# EAGLE design SimpleSwitchOrig (EAGLE 6.6.0)
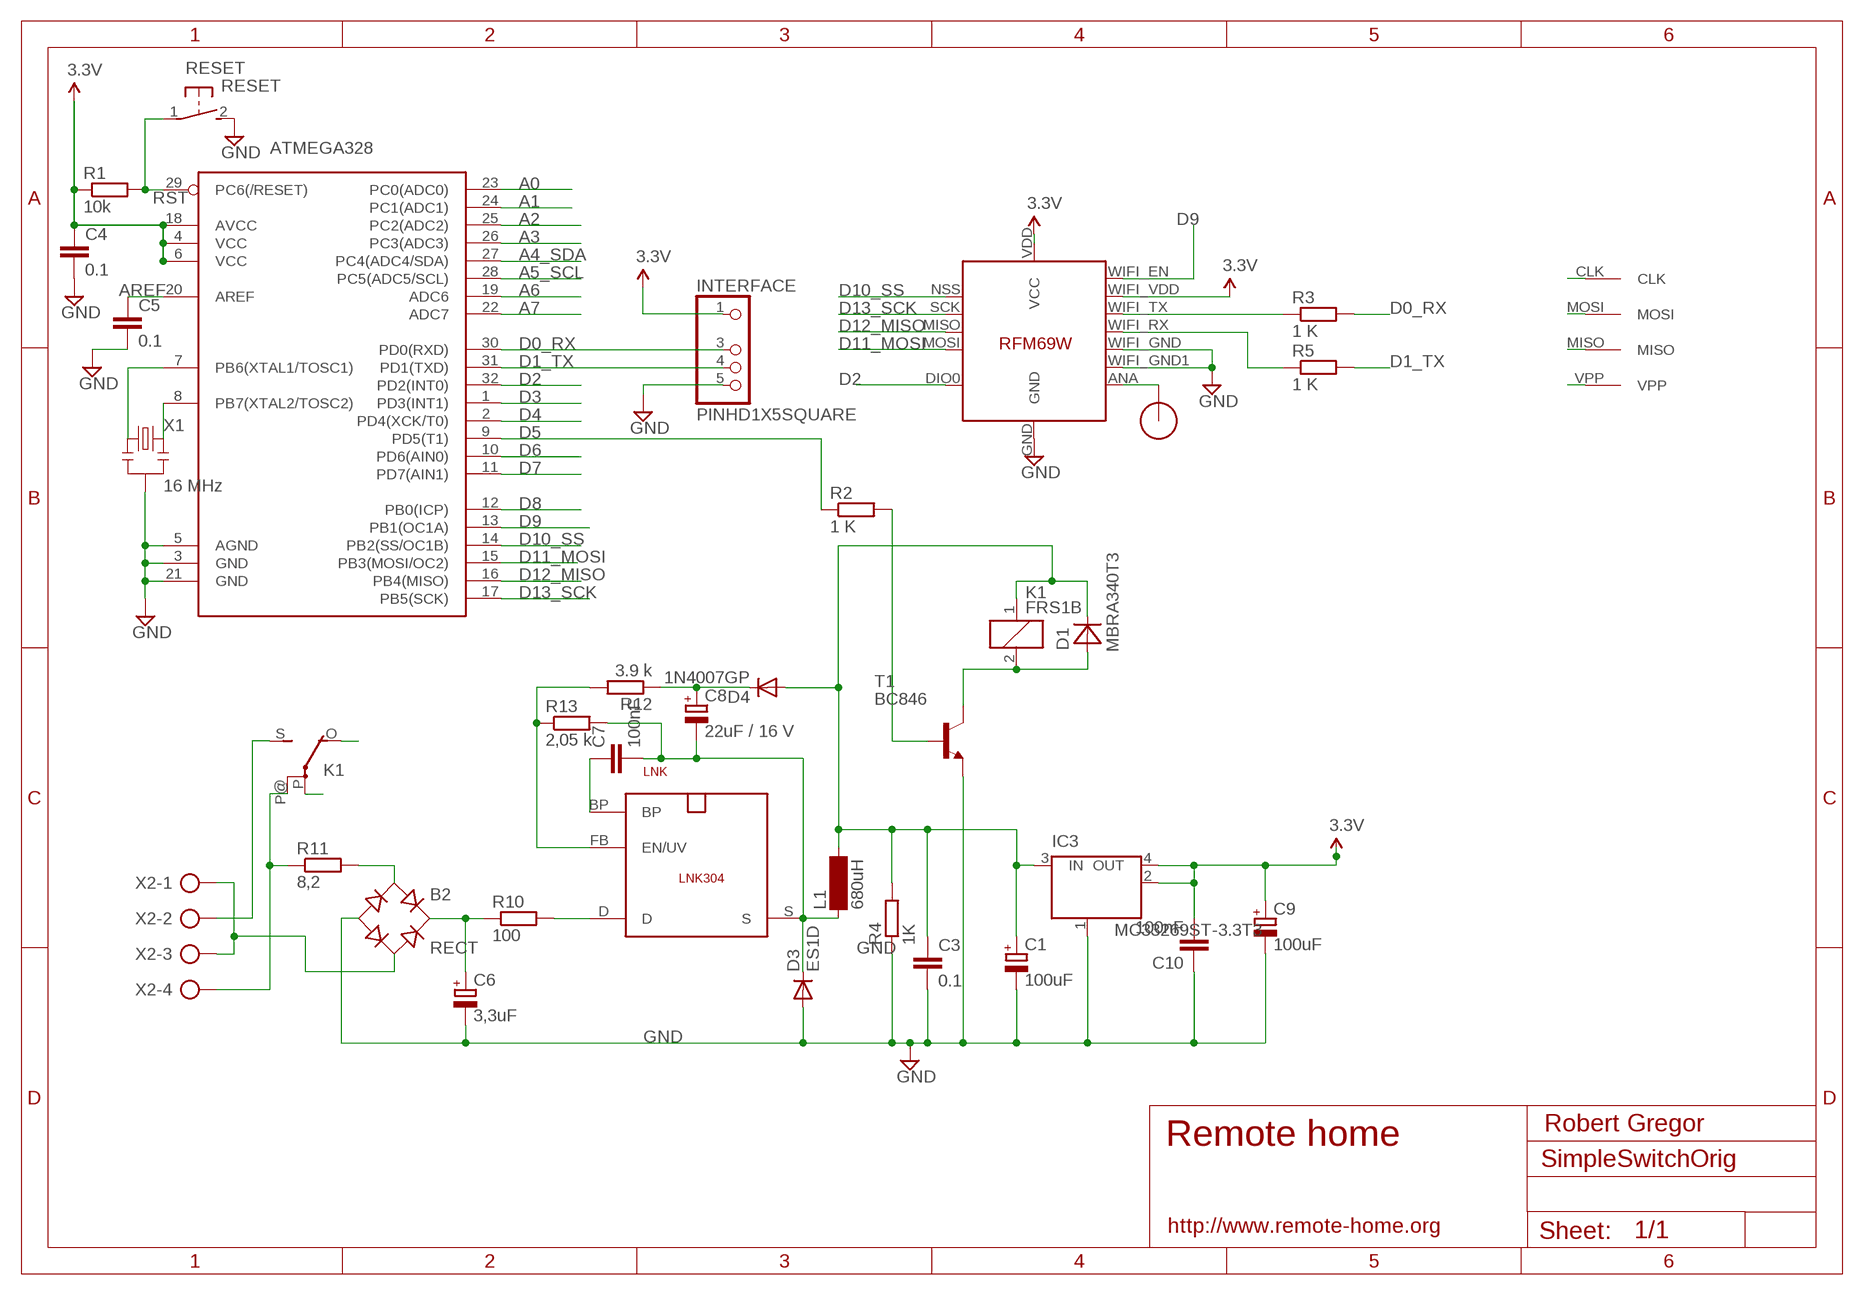
[diagram p0: schematic, sheet 1]

## Parts
ATMEGA328  ATMega-328  ATMEGA168/328TQFP32  [TQFP32-08]
B2  RECT  RECTIFIER-S40  [TO-269AA]
C1  100uF  CPOL-EUSMCB  [SMC_B]
C3  0.1  C-EUC2012  [C2012]
C4  0.1  C-EUC2012  [C2012]
C5  0.1  C-EUC2012  [C2012]
C6  3,3uF  CPOL-EUE5-10.5  [E5-10,5]
C7  100nF  C-EUC2012  [C2012]
C8  22uF / 16 V  CPOL-EUSMCC  [SMC_C]
C9  100uF  CPOL-EUSMCB  [SMC_B]
C10  100nF  C-EUC2012  [C2012]
D1  MBRA340T3  [SMA]
D3  ES1D  DIODE-DO214AC  [DO214AC]
D4  1N4007GP  DIODE-DO214AA  [DO214AA]
IC3  MC33269ST-3.3T3  [SOT223]
INTERFACE  PINHD1X5SQUARE  [PINHD1X05-SQUARE]
K1  FRS1B  [FRS1B]
L1  680uH  BS11  [BS11]
LNK  LNK304  SO-8C  [SO-8C]
R1  10k  R-EU_R2012  [R2012]
R2  1 K  R-EU_M2012  [M2012]
R3  1 K  R-EU_M2012  [M2012]
R4  1K  R-EU_M2012  [M2012]
R5  1 K  R-EU_M2012  [M2012]
R10  100  R-EU_R2512W  [R2512W]
R11  8,2  R-EU_0411/12  [0411/12]
R12  3.9 k  R-EU_M2012  [M2012]
R13  2,05 k  R-EU_M2012  [M2012]
RESET  RESET  DTSM-3  [DTSM-3]
RFM69  RFM69-ESP03  [RFM69W-ESP03]
T1  BC846  [SOT23]
U$1  RFM12B_ANTENNA  [RFM12B-ANTENNA]
U$2  AVRHEADERDIP  [AVRHEADER]
X1  16 MHz  RESONATORSMD  [RESONATOR-SMD]
X2  AK500/4  [AK500/4]

## Nets
5V: C1.+ C3.1 D1.C D4.A IC3.3(IN) K1.1 L1.2 R4.2
A0: ATMEGA328.23(PC0(ADC0))
A1: ATMEGA328.24(PC1(ADC1))
A2: ATMEGA328.25(PC2(ADC2))
A3: ATMEGA328.26(PC3(ADC3))
A4_SDA: ATMEGA328.27(PC4(ADC4/SDA))
A5_SCL: ATMEGA328.28(PC5(ADC5/SCL))
A6: ATMEGA328.19(ADC6)
A7: ATMEGA328.22(ADC7)
AREF: ATMEGA328.20(AREF) C5.1
D0_RX: ATMEGA328.30(PD0(RXD)) INTERFACE.3 R3.2
D1_TX: ATMEGA328.31(PD1(TXD)) INTERFACE.4 R5.2
D2: ATMEGA328.32(PD2(INT0)) RFM69.DIO0
D3: ATMEGA328.1(PD3(INT1))
D4: ATMEGA328.2(PD4(XCK/T0))
D5: ATMEGA328.9(PD5(T1)) R2.1
D6: ATMEGA328.10(PD6(AIN0))
D7: ATMEGA328.11(PD7(AIN1))
D8: ATMEGA328.12(PB0(ICP))
D9: ATMEGA328.13(PB1(OC1A)) RFM69.WIFI_EN
D10_SS: ATMEGA328.14(PB2(SS/OC1B)) RFM69.NSS(SEL)
D11_MOSI: ATMEGA328.15(PB3(MOSI/OC2)) RFM69.MOSI U$2.MOSI
D12_MISO: ATMEGA328.16(PB4(MISO)) RFM69.MISO U$2.MISO
D13_SCK: ATMEGA328.17(PB5(SCK)) RFM69.SCK U$2.CLK
FB: LNK.FB(EN/UV) R12.2 R13.1
GND [power]: ATMEGA328.3(GND) ATMEGA328.5(AGND) ATMEGA328.21(GND) B2.- C1.- C3.2 C4.2 C5.2 C6.- C9.- C10.1 D3.A IC3.1(GND/ADJ) INTERFACE.5 R4.1 RESET.2 RFM69.GND RFM69.WIFI_GND RFM69.WIFI_GND1 T1.2(E) X1.2
N$1: ATMEGA328.7(PB6(XTAL1/TOSC1)) X1.1
N$2: R2.2 T1.1(B)
N$3: RFM69.ANA(ANT) U$1.P$1
N$4 [220V]: K1.P(2:P)
N$5: D1.A K1.2 T1.3(C)
N$6 [220V]: K1.O(2:O)
N$7 [220V]: K1.S(2:S) X2.2
N$8 [220V]: K1.P@(2:P) R11.1 X2.4
N$9 [220V]: B2.AC2 X2.1 X2.3
N$10: R3.1 RFM69.WIFI_TX
N$11: R5.1 RFM69.WIFI_RX
N$13 [220V]: LNK.D R10.2
N$14 [220V]: B2.+ C6.+ R10.1
N$15 [220V]: B2.AC1 R11.2
N$18: C7.1 LNK.BP
N$20: C8.+ D4.C R12.1
N$21: ATMEGA328.8(PB7(XTAL2/TOSC2)) X1.3
RST: ATMEGA328.29(PC6(/RESET)) R1.2 RESET.1 U$2.VPP
S: C7.2 C8.- D3.C L1.1 LNK.S R13.2
VCC: ATMEGA328.4(VCC) ATMEGA328.6(VCC) ATMEGA328.18(AVCC) C4.1 C9.+ C10.2 IC3.2(OUT) IC3.4(OUT) INTERFACE.1 R1.1 RFM69.VDD(VCC) RFM69.WIFI_VDD ; supply symbol labelled 3.3V

## Notes on the sheet
- Robert Gregor
- Remote home
- http://www.remote-home.org

## Library data of the parts
ATMEGA328 = LowPowerLab:ATMEGA168/328: Atmel 32-pin 8-bit micro, 16k flash.
B2 = rectifier:RECTIFIER-: Rectifier
C1 C6 C8 C9 = resistor:CPOL-EU: POLARIZED CAPACITOR, European symbol
C3-C5 C7 C10 = resistor:C-EU: CAPACITOR, European symbol
D1 = diode:MBRA340T3: Surface Mount Schottky Power Rectifier Source: http://www.onsemi.com/pub_link/Collateral/MBRA340T3-D.PDF
D3 D4 = diode:DIODE-: DIODE
IC3 = linear:MC33269ST*: Adjustable Output Low Dropout Voltage Regulator 800 mA Source: http://www.onsemi.com/pub/Collateral/MC33269-D.PDF
INTERFACE = eagle-library-edeca.net-v5:PINHD1X5
K1 = relay:FRS1B: RELAY 1 x switch, same as V23101-D6-A201, Siemens; OC_FARNELL: unknown; OC_NEWARK: unknown
L1 = inductor-neosid:BS: INDUCTOR nominal inductance, magnetically screened; OC_FARNELL: unknown; OC_NEWARK: unknown
LNK = powerint:SO-8C: 700V MOSFET für Schaltnetz-Trafos. Pin 3 fehlt. SMD
R1-R5 R10-R13 = resistor:R-EU_: RESISTOR, European symbol
RESET = switch-tact:DTSM-3
RFM69 = RemoteHome:RFM69-ESP03
T1 = transistor:BC846: NPN TRANSISTOR
U$1 = LowPowerLab:RFM12B_ANTENNA
U$2 = RemoteHome:AVRHEADER
X1 = SparkFun:RESONATOR: Resonator Small SMD resonator. This is the itty bitty 10/20MHz resonators with built in caps. CSTCE10M0G55 and CSTCE20M0V53. Footprint has been reviewed closely but hasn't been tested yet.
X2 = con-ptr500:AK500/4: CONNECTOR; OC_FARNELL: unknown; OC_NEWARK: unknown

## Net classes
1 power: width 0.381 mm, clearance 0.254 mm
2 220V: width 0.381 mm, clearance 0.508 mm

## Board
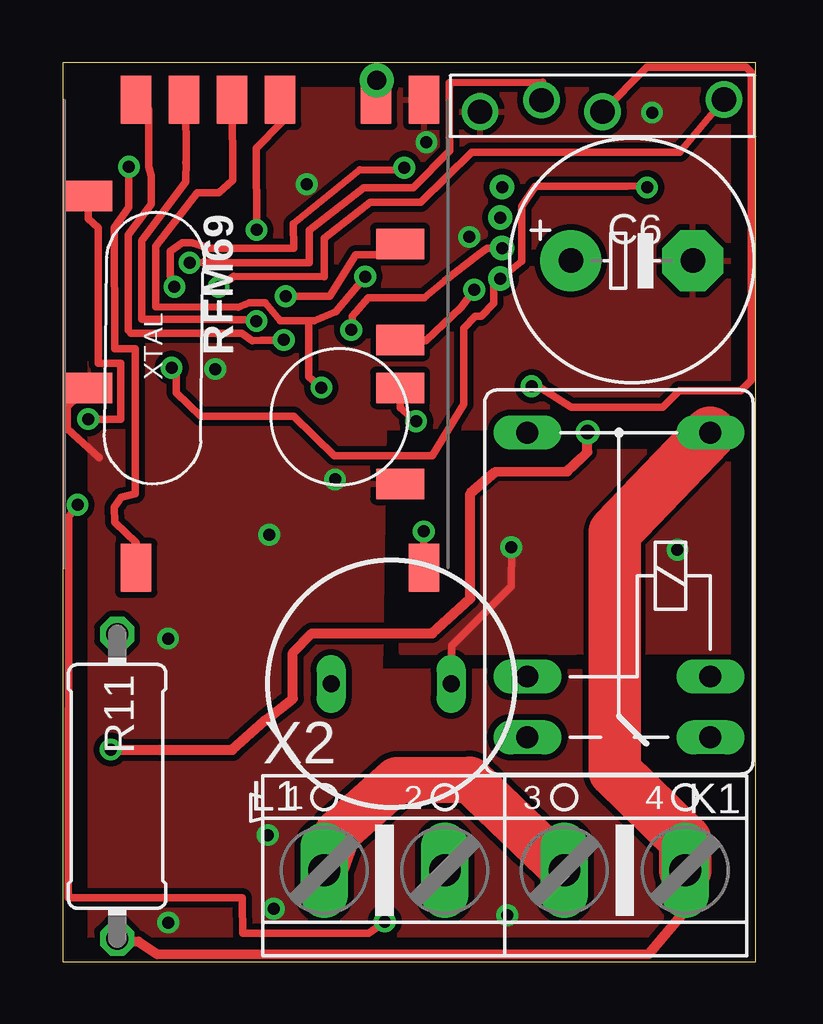
[diagram p1: board, top side]
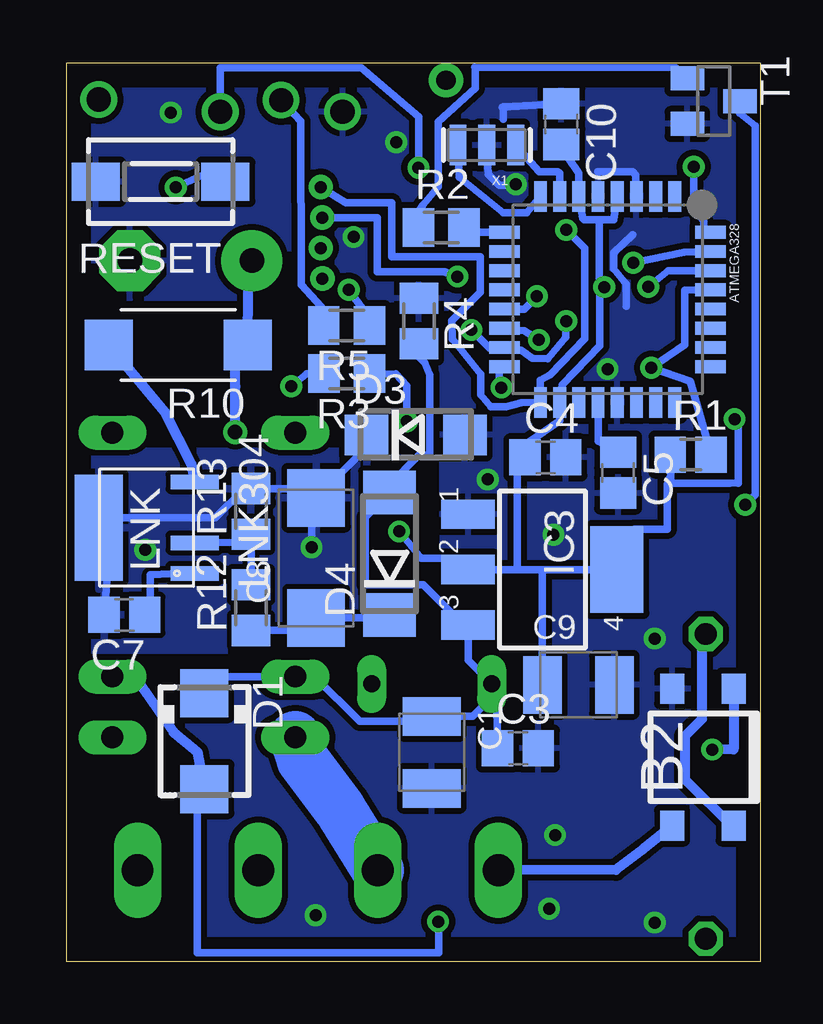
[diagram p2: board, bottom side, seen from below]

Size 28.88 x 37.45 mm. Coordinates in mm from the lower left corner, seen from the top.
Outline: 0,0 28.88,0 28.88,37.45 0,37.45 0,0
Copper layers (1*16): Top 0.035mm / dielectric 1.5mm / Bottom 0.035mm
Design rules "default": minimum track width 10mil, minimum drill 24mil, track to track 8mil, track to pad 8mil, pad to pad 8mil, via to via 8mil, smd to smd 8mil, copper to edge 40mil, drill to drill 8mil, minimum pad ring 10mil, minimum via ring 8mil, stop-mask expansion 4mil, vias tented up to drill 0mil, thermal gap 10mil

### Footprints (pad centres in the part's own frame; a part is rotated, then mirrored left to right if it is on the bottom)
TQFP32-08 = smd 1.27 x 0.533: 1 -4.293,2.8; 2 -4.293,2; 3 -4.293,1.2; 4 -4.293,0.4; 5 -4.293,-0.4; 6 -4.293,-1.2; 7 -4.293,-2; 8 -4.293,-2.8; 17 4.293,-2.8; 18 4.293,-2; 19 4.293,-1.2; 20 4.293,-0.4; 21 4.293,0.4; 22 4.293,1.2; 23 4.293,2; 24 4.293,2.8 | smd 0.533 x 1.27: 9 -2.8,-4.293; 10 -2,-4.293; 11 -1.2,-4.293; 12 -0.4,-4.293; 13 0.4,-4.293; 14 1.2,-4.293; 15 2,-4.293; 16 2.8,-4.293; 25 2.8,4.293; 26 2,4.293; 27 1.2,4.293; 28 0.4,4.293; 29 -0.4,4.293; 30 -1.2,4.293; 31 -2,4.293; 32 -2.8,4.293
TO-269AA = smd 1 x 1.25: + -1.28,-2.855; - 1.28,-2.855; AC1 -1.28,2.855; AC2 1.28,2.855
SMC_B = smd 1.6 x 2.4: + -1.5,0; - 1.5,0
C2012 = smd 1.3 x 1.5: 1 -0.85,0; 2 0.85,0
E5-10,5 = drill 1.016 pad 2.54: + -2.54,0 | drill 1.016 pad 2.54 octagon: - 2.54,0
SMC_C = smd 2.4 x 2.4: + -2.5,0; - 2.5,0
SMA = smd 2 x 2: A 2,0; C -2,0
DO214AC = smd 1.8 x 1.7: A 2.05,0; C -2.05,0
DO214AA = smd 1.8 x 2.2: A 2.55,0; C -2.55,0
SOT223 = smd 1.219 x 2.235: 1 -2.311,-3.099; 2 0,-3.099; 3 2.311,-3.099 | smd 3.6 x 2.2: 4 0,3.099
PINHD1X05-SQUARE = drill 1.016: 1 -5.061,-0.269; 3 0,0.24; 4 2.54,-0.24; 5 5.099,0.24
FRS1B = drill 0.914 long: 1 0,3.81; 2 0,-3.81; O -2.54,-3.81; P 10.16,3.81; P@ 10.16,-3.81; S -2.54,3.81
BS11 = drill 0.7 long: 1 -2.5,0; 2 2.5,0
SO-8C = smd 0.6 x 2: BP -1.905,-2; D 1.905,-2; FB -0.635,-2 | smd 4.41 x 2: S 0,2
R2012 = smd 1.3 x 1.5: 1 -0.85,0; 2 0.85,0
M2012 = smd 1.3 x 1.6: 1 -0.95,0; 2 0.95,0
R2512W = smd 2 x 2.1: 1 -2.896,0; 2 2.896,0
0411/12 = drill 0.914 octagon: 1 -6.35,0; 2 6.35,0
DTSM-3 = smd 2 x 1.6: 1 -2.7,0; 2 2.7,0
RFM69W-ESP03 = smd 2 x 1.27: ANA 8,-5; DIO0 -11.5,5; GND 8,-7; MISO 8,1; MOSI 8,3; NSS 8,5; SCK 8,-1; VDD -11.5,-7 | smd 1.27 x 2: WIFI_EN 2,-6; WIFI_GND -8,-6; WIFI_GND1 -4,7; WIFI_RX -2,-6; WIFI_TX -4,-6; WIFI_VDD 4,7
SOT23 = smd 1 x 1.4: 1 -0.95,-1.1; 2 0.95,-1.1; 3 0,1.1
RFM12B-ANTENNA = drill 0.8 pad 1.422: P$1 0,0
AVRHEADER = drill 0.5: CLK 2.54,0; MISO 1.27,0.07; MOSI 0,0; VPP -1.27,0.072
RESONATOR-SMD = smd 0.7 x 1.7: 1 -1.2,0; 2 0,0; 3 1.2,0
AK500/4 = drill 1.321 long: 1 -7.518,0; 2 -2.489,0; 3 2.489,0; 4 7.518,0

### Placement (x,y rotation side)
ATMEGA328  6.35,27.59 270 bottom
B2  2.38,8.52 180 bottom
C1  13.68,8.72 270 bottom
C3  10.09,8.89 0 bottom
C4  8.94,21.01 0 bottom
C5  5.91,20.38 270 bottom
C6  23.71,29.21 0 top
C7  26.48,14.45 180 bottom
C8  18.49,16.82 90 bottom
C9  7.57,11.54 0 bottom
C10  8.28,34.9 270 bottom
D1  23.15,9.19 270 bottom
D3  14.34,21.95 0 bottom
D4  15.43,17 90 bottom
IC3  9.06,16.34 270 bottom
INTERFACE  22.49,35.66 180 top
K1  23.17,11.88 90 top
L1  13.68,11.58 180 top
LNK  25.56,18.08 90 bottom
R1  2.89,21.13 0 bottom
R2  13.28,30.59 180 bottom
R3  17.22,24.5 180 bottom
R4  14.21,26.69 270 bottom
R5  17.22,26.51 180 bottom
R10  24.24,25.69 180 bottom
R11  2.27,7.3 90 top
R12  21.21,14.75 90 bottom
R13  21.21,18.76 90 bottom
RESET  24.97,32.5 180 bottom
RFM69  8.06,27.91 90 top
T1  1.93,35.86 270 bottom
U$1  13.08,36.73 0 top
U$2  18.3,29.74 90 top
X1  11.38,34.03 180 bottom
X2  18.41,3.81 0 top

### Tracks (layer width: path | path; a pad name or v marks a point on that pad's centre or on a via)
5V
  Bottom 0.305: D1.C 22.82,11.88 K1.1 18.55,11.88 16.68,10.01 14.13,10.01 | 14.13,10.01 13.89,10.01 C1.+ 11.96,10.23 11.18,11 L1.2 | 13.74,10.4 14.13,10.01 | L1.2 | L1.2 12.16,12.56 IC3.3 12.35,14.03 14.04,15.71 16.45,15.71 16.45,18.53 D4.A 15.44,19.88 14.22,21.09 13.76,21.1 13.76,22.87 13.76,23.25 13.76,23.43 13.77,23.64 13.77,24.46 13.97,24.95 14.77,25.75 R4.2 | C3.1 10.96,11.36 L1.2
AREF
  Bottom 0.305: ATMEGA328.20 6.75,21.69 C5.1
D0_RX  (via drill 0.5)
  Top 0.305: v4.66,28.12 4.48,28.58 4.48,29.61 4.99,29.95 5.38,29.95 6.12,29.72 9.62,29.72 9.61,30.76 12.37,32.99 14.1,32.97 v14.23,33.08 | v19.53,23.98 19.94,23.9 21.19,23.1 25,23.1 25.69,23.78 26.13,23.78 26.2,23.78 28.25,23.78 28.68,24.22 28.68,37.07 28.49,37.27 24.34,37.27 INTERFACE.3
  Bottom 0.305: v4.66,28.12 3.81,28.79 ATMEGA328.30 | v14.23,33.08 14.22,33.8 14.22,35.21 16.62,37.26 22.48,37.25 INTERFACE.3 | R3.2 18.89,24.5 v19.53,23.98
D1_TX  (via drill 0.5)
  Top 0.305: INTERFACE.4 19.99,36.15 20,36.64 16.11,36.63 16.11,34.79 16.12,33.78 14.61,32.25 12.55,32.24 10.26,30.47 10.26,29.11 8.45,29.11 6.79,29.12 6.5,29.12 6.17,29.12 6,29.13 v5.29,29.12
  Bottom 0.305: ATMEGA328.31 3.15,29.55 v5.29,29.12 | R5.2 18.46,25.99 18.28,26.52 18.28,27.29 19.11,28.2 19.13,35.03 INTERFACE.4
D2  (via drill 0.5)
  Top 0.305: v2.76,33.12 2.76,31.44 2.15,30.57 2.16,30.51 2.16,25.69 2.16,25.55 3.03,25.55 3.03,19.5 2.44,19.35 2.15,18.93 2.16,18.31 3.06,17.46 RFM69.DIO0 3.08,16.42
  Bottom 0.305: v2.76,33.12 2.75,31.47 2.34,30.85 2.33,30.45 2.1,30.37 2.08,30.39 ATMEGA328.32
D5
  Bottom 0.305: ATMEGA328.9 12.34,30.39 R2.1
D9  (via drill 0.5)
  Top 0.305: v9.29,27.73 11.13,27.73 12.21,29.45 13.07,29.45 RFM69.WIFI_EN
  Bottom 0.305: ATMEGA328.13 9.82,27.19 v9.29,27.73
D10_SS  (via drill 0.5)
  Top 0.305: RFM69.NSS 3.58,35.52 3.58,33.34 3.58,33.12 3.69,32.74 3.69,31.88 3.69,31.57 2.73,30.3 2.73,26.3 2.83,26.18 7.45,26.18 7.89,25.88 8.28,25.89 9.08,25.89 v9.21,25.91
  Bottom 0.305: ATMEGA328.14 10.62,26.37 9.82,26.28 v9.21,25.91
D11_MOSI  (via drill 0.5)
  Top 0.305: v8.07,26.69 7.85,26.75 7,26.74 6.18,26.76 3.29,26.76 3.29,30.04 5.13,32.49 5.14,33.39 | 5.14,33.39 5.13,35.87 RFM69.MOSI | 5.13,33.28 5.14,33.39 | v12.02,26.32 12.06,26.54 12.06,26.9 12.73,27.67 14.76,27.67 15.06,27.66 15.92,28.38 17.32,29.45 17.7,29.73 U$2.MOSI
  Bottom 0.305: v8.07,26.69 8.09,26.01 8.85,25.13 9.5,25.15 9.94,25.48 ATMEGA328.15 11.01,25.59 11.25,25.56 v12.02,26.32
D12_MISO  (via drill 0.5)
  Top 0.305: 10.24,26.71 10.48,26.71 11.38,27.08 v12.61,28.55 | 10.24,26.71 10.25,24.87 10.26,24.38 v10.78,23.92 | 10.24,26.71 10.22,26.71 9.07,26.71 8.44,27.46 7.78,27.45 7.31,27.27 3.88,27.3 3.87,27.85 3.87,29.8 5.6,32.03 6.05,32.03 6.5,32.03 7.07,32.57 RFM69.MISO
  Bottom 0.305: v10.78,23.92 10.86,24.25 10.85,24.79 10.51,24.77 ATMEGA328.16 | U$2.MISO 15.94,31 15.94,28.76 13.15,28.76 v12.61,28.55
D13_SCK  (via drill 0.5)
  Top 0.305: v8.07,30.49 8.07,33.9 9.12,34.99 9.12,35.87 RFM69.SCK 9.26,36.1
  Bottom 0.305: v8.07,30.49 7.3,29.74 7.3,27.86 7.3,25.95 8.74,24.45 9.15,24.23 ATMEGA328.17 9.95,23.3 10.58,23.12 11.21,23.13 11.64,23.63 11.63,24.48 12.8,25.94 12.83,25.94 12.85,26.7 11.66,27.88 11.66,29.36 15.35,29.36 15.35,31.62 17.26,31.61 U$2.CLK
FB
  Bottom 0.305: LNK.FB 21.54,17.49 R13.1 R12.2
GND  (via drill 0.5)
  Top 0.305: RFM69.WIFI_GND1 1.02,23.91 0.2,23.11 0.2,22.2 1.53,20.99 | v10.17,32.39 10.3,32.3 10.07,32.53
  Bottom 0.305: 5.07,31.52 ATMEGA328.3 5.17,31.62 5.17,32.78 5.31,32.91 6.76,32.91 | 5.3,30.3 6.1,29.53 6.1,28.88 5.57,28.23 5.57,27.3 | X1.2 11.32,32.8 10.87,32.35 10.5,32.35 v10.17,32.39 | 10.71,35.11 10.71,35.62 C10.1 10.73,35.6 10.74,35.6
  other vias: 8.54,5.27 4.39,13.47 18.52,1.93 4.39,1.63 8.79,2.21 8.6,17.79 11.35,20.09 6.35,24.69 24.55,35.38 16.94,30.2 15.16,34.14
  pour Top: 0.13,37.3 28.75,37.3 28.71,22.3 13.37,22.24 13.21,12.12 28.72,12.09 28.75,0.13 0.13,0.13
  pour Bottom (rank 2): 0.19,37.3 28.75,37.3 28.76,27.67 18.63,27.67 18.63,22.12 13.29,22.17 13.2,12.15 28.73,12.12 28.75,0.13 0.16,0.13 0.16,37.33
N$1
  Bottom 0.305: ATMEGA328.7 8.35,32.86 8.43,32.92 9.19,32.92 X1.1
N$2
  Bottom 0.305: T1.1 3.52,36.8 3.52,37.26 11.88,37.26 11.87,37.23 11.87,36.39 13.41,35 13.41,32.29 14.06,31.51 14.47,30.86 14.72,30.61 14.63,30.56 R2.2
N$3
  Top 0.406: RFM69.ANA 13.12,35.87 U$1.P$1
N$5  (via drill 0.5)
  Top 0.305: v13.41,1.67 | v13.41,1.67 12.74,1.19 7.51,1.19 7.49,2.48 | 7.49,2.48 7.49,2.64 | 7.49,2.48 7.49,2.67 0.22,2.67 0.24,18.54 v0.61,19.04
  Bottom 0.305: D1.A 23.23,7.41 23.44,6.63 23.45,0.37 13.39,0.37 13.39,1.29 v13.41,1.67 | T1.3 0.84,35.8 0.84,35.35 0.19,34.83 0.19,32.55 0.2,31.38 0.2,30.84 0.2,19.45 v0.61,19.04
  Bottom 0.406: K1.2 26.03,11.86 24.43,9.55 23.44,8.74 D1.A
N$7
  Bottom 2.184: K1.S 19.05,8.41 17.53,6.4 X2.2
N$8
  Top 0.406: R11.1 3.15,0.83 3.93,0.32 24.43,0.32 25.99,2.18 25.99,3.75 X2.4
  Top 2.184: X2.4 25.93,5.06 22.99,7.94 22.99,17.89 K1.P@
N$9
  Top 1.93: X2.1 11.46,5.36 13.91,7.57 16.95,7.59 X2.3
  Bottom 0.406: B2.AC2 4.85,4.7 6.01,3.82 10.88,3.82 X2.1
N$10  (via drill 0.5)
  Top 0.305: RFM69.WIFI_TX 14.07,23.92 14.07,23.08 v14.72,22.52
  Bottom 0.305: v14.72,22.52 14.72,24 15.17,24.49 16.25,24.48 R3.1
N$11  (via drill 0.5)
  Top 0.305: v17.14,28 16.61,27.28 15.12,25.88 RFM69.WIFI_RX
  Bottom 0.305: R5.1 16.43,27.02 v17.14,28
N$13
  Bottom 0.406: R10.2 24.8,22.9 23.69,20.73 LNK.D
N$14  (via drill 0.5, 0.6)
  Top 0.406: v2,8.84 7.07,8.83 8.41,10.05 8.42,10.05 9.59,10.96 9.59,12.87 10.38,13.68 15.4,13.68 16.98,15.13 16.98,19.52 18.03,20.41 21.02,20.43 21.63,21 21.86,21.23 v21.87,22.06
  Bottom 0.406: B2.+ 1.1,8.84 v2,8.84 | C6.+ 21.33,28.09 R10.1 21.86,25.35 21.86,23.97 21.87,23.34 v21.87,22.06
N$15
  Bottom 0.406: R11.2 2.42,13.55 2.42,10.11 3.13,9.4 3.13,7.61 1.12,5.59 1.15,5.4 B2.AC1
N$18
  Bottom 0.305: C7.1 25.39,14.31 25.4,16.12 24.53,16.16 LNK.BP
N$20
  Bottom 0.305: R12.1 19.02,13.8 C8.+ 15.56,14.32 D4.C
N$21
  Bottom 0.305: 9.15,31.6 ATMEGA328.8 9.73,31.22 10.7,31.22 12.52,32.69 X1.3
RST  (via drill 0.5)
  Top 0.305: v24.35,32.26 24.01,32.33 23.51,32.31 19.68,32.31 19.13,31.47 19.13,29.7 19.13,29.18 U$2.VPP 17.96,28.21 17.96,27.43 17.43,26.89 17.19,26.89 16.7,26.39 16.7,23.22 15.4,21.08 11.31,21.08 9.63,22.74 5.76,22.74 4.73,23.7 4.73,24.75 v4.53,24.75
  Bottom 0.305: ATMEGA328.29 3.13,27.97 3.13,27.03 3.15,25.7 v4.53,24.75 2.91,24.19 R1.2 | RESET.1 23.04,32.86 v24.35,32.26
S  (via drill 0.5)
  Top 0.305: L1.1 16.22,13.16 18.69,15.64 18.72,17.27 v18.69,17.27
  Bottom 0.305: 27.33,17.59 LNK.S 27.12,18.49 22.7,18.49 21.47,19.71 R13.2 18.88,19.71 C8.- | 27.33,17.59 26.88,16.1 | C7.2 27.09,17.36 27.33,17.59 | v18.69,17.27 18.69,19.13 C8.- | D3.C 16.09,21.73 C8.-
  other vias: 25.61,17.16
  pour Bottom: 28.72,21.3 14.04,21.27 14.01,12.99 28.73,12.96 28.71,19.67 28.72,20.37 28.72,20.67
  pour Top: 28.6,21.22 14.24,21.21 14.14,12.92 28.67,12.95 28.73,21.22
VCC  (via drill 0.5)
  Top 0.305: RFM69.VDD 15.05,16.54 v15.04,17.93 | INTERFACE.1 25.71,33.73 22,33.73 17.04,33.73 14.93,31.64 12.81,31.64 10.89,30.14 10.89,28.54 7.12,28.55 v6.49,28.11 | RFM69.WIFI_VDD 1.06,30.96 1.47,30.59 1.48,24.99 1.48,24.93 2.41,24.94 2.41,24.34 2.41,22.61 v1.06,22.61
  Bottom 0.305: ATMEGA328.4 6.1,30.91 6.7,30.91 | 6.7,30.91 7.32,30.91 7.39,30.98 ATMEGA328.6 7.55,32.85 7.99,33.5 C10.2 | 10.19,16.34 IC3.2 12.64,16.81 14.12,16.8 v15.04,17.93 | 10.19,16.34 9.02,16.34 | 9.02,16.34 IC3.4 5.24,18.01 3.88,18.02 3.88,19.88 3.74,20.2 3.71,19.94 | C9.+ 9.07,16.29 9.02,16.34 | R1.1 3.71,19.94 | 10.19,16.34 10.11,16.41 10.11,20.8 9.72,21.28 C4.1 9.62,21.67 8.34,22.54 ATMEGA328.18 8.23,24.05 6.68,25.65 6.68,27.84 6.63,28.12 v6.49,28.11 6.7,28.47 6.7,30.91 | v1.06,22.61 0.95,22.48 0.9,22.43 0.9,19.93 0.99,19.95 1.26,19.93 3.71,19.94